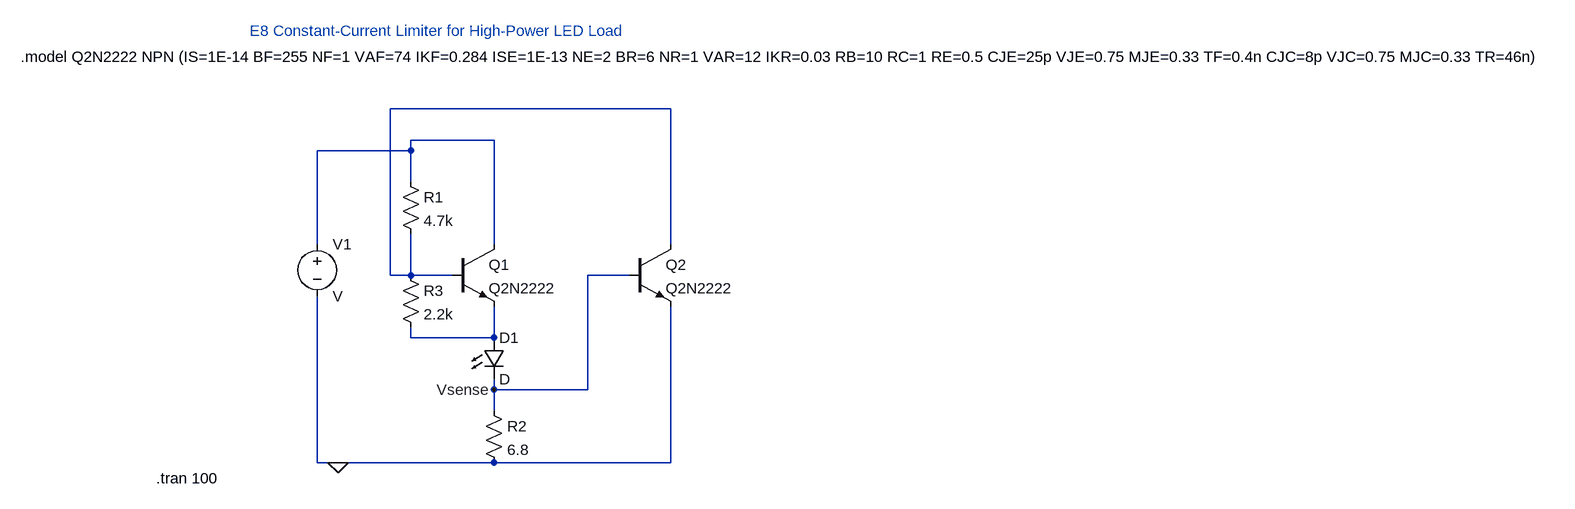
[diagram p0: schematic Constant-Current Limiter .asc]
Constant-Current Limiter .asc, the LTspice schematic file:
Version 4
SHEET 1 2344 680
WIRE 832 -16 400 -16
WIRE 560 32 432 32
WIRE 432 48 432 32
WIRE 432 48 288 48
WIRE 432 96 432 48
WIRE 288 192 288 48
WIRE 560 192 560 32
WIRE 832 192 832 -16
WIRE 400 240 400 -16
WIRE 432 240 432 176
WIRE 432 240 400 240
WIRE 496 240 432 240
WIRE 768 240 704 240
WIRE 432 336 432 320
WIRE 560 336 560 288
WIRE 560 336 432 336
WIRE 560 416 560 400
WIRE 704 416 704 240
WIRE 704 416 560 416
WIRE 560 448 560 416
WIRE 288 528 288 272
WIRE 320 528 288 528
WIRE 560 528 320 528
WIRE 832 528 832 288
WIRE 832 528 560 528
FLAG 320 528 0
FLAG 560 416 Vsense
SYMBOL res 416 80 R0
SYMATTR InstName R1
SYMATTR Value 4.7k
SYMBOL npn 496 192 R0
SYMATTR InstName Q1
SYMATTR Value Q2N2222
SYMBOL LED 544 336 R0
SYMATTR InstName D1
SYMBOL res 544 432 R0
SYMATTR InstName R2
SYMATTR Value 6.8
SYMBOL npn 768 192 R0
SYMATTR InstName Q2
SYMATTR Value Q2N2222
SYMBOL res 416 224 R0
SYMATTR InstName R3
SYMATTR Value 2.2k
SYMBOL voltage 288 176 R0
SYMATTR InstName V1
TEXT 40 552 Left 2 !.tran 100
TEXT -168 -96 Left 2 !.model Q2N2222 NPN (IS=1E-14 BF=255 NF=1 VAF=74 IKF=0.284 ISE=1E-13 NE=2 BR=6 NR=1 VAR=12 IKR=0.03 RB=10 RC=1 RE=0.5 CJE=25p VJE=0.75 MJE=0.33 TF=0.4n CJC=8p VJC=0.75 MJC=0.33 TR=46n)
TEXT 184 -136 Left 2 ;E8 Constant-Current Limiter for High-Power LED Load

The netlist it stands for:
* Constant-Current Limiter .asc
R1 N002 N001 4.7k
Q1 N002 N001 N003 0 Q2N2222
D1 N003 Vsense D
R2 Vsense 0 6.8
Q2 N001 Vsense 0 0 Q2N2222
R3 N001 N003 2.2k
V1 N002 0 V
.model D D
.lib standard.dio
.model NPN NPN
.model PNP PNP
.lib standard.bjt
.tran 100
.model Q2N2222 NPN (IS=1E-14 BF=255 NF=1 VAF=74 IKF=0.284 ISE=1E-13 NE=2 BR=6 NR=1 VAR=12 IKR=0.03 RB=10 RC=1 RE=0.5 CJE=25p VJE=0.75 MJE=0.33 TF=0.4n CJC=8p VJC=0.75 MJC=0.33 TR=46n)
* E8 Constant-Current Limiter for High-Power LED Load
.backanno
.end